# Altium project Light Sensor.PrjPCB
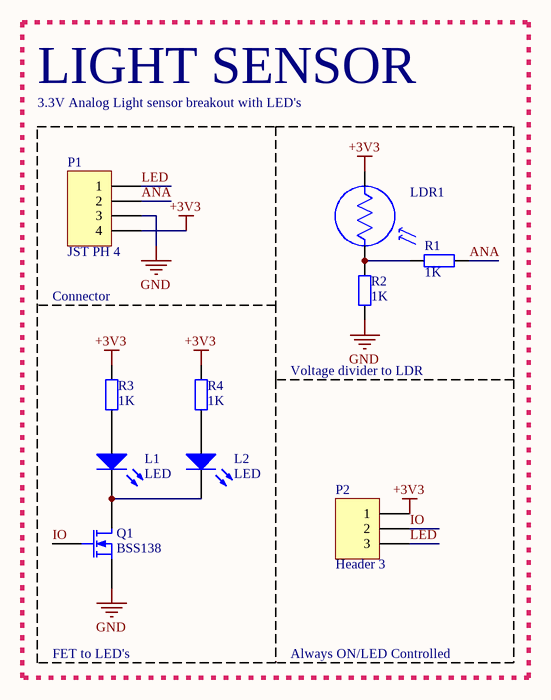
[diagram p0: Light Sensor Breakout.SchDoc]
1 sheet, 10 parts. Net scope: global (net labels, ports and power ports of the same name join across sheets).
Board file: Light Sensor Breakout.PcbDoc

## Sheet Light Sensor Breakout.SchDoc
size A4

### Parts
L1  LED  [LED-5mm]
L2  LED  [LED-5mm]
LDR1  LDR  [LDR-5mm]  (value not drawn)
P1  JST PH 4  [B4B-PH-K]
P2  Header 3  [HDR1X3]
Q1  BSS138  [SOT23]
R1  1K  [RES1206]
R2  1K  [RES1206]
R3  1K  [RES1206]
R4  1K  [RES1206]

### Nets
+3V3: LDR1.1 P1.4 P2.1 R3.2 R4.2
GND: P1.3 Q1.2(S) R2.1
ANA: P1.2 R1.1
IO: P2.2 Q1.3(G)
LED: P1.1 P2.3
NetL1_1: L1.1(A) R3.1
NetL1_2: L1.2(K) L2.2(K) Q1.1(D)
NetL2_1: L2.1(A) R4.1
NetLDR1_2: LDR1.2 R1.2 R2.2

### Notes on the sheet
- LIGHT SENSOR
- 3.3V Analog Light sensor breakout with LED's
- Connector
- Voltage divider to LDR
- FET to LED's
- Always ON/LED Controlled

### Library data of the parts
P2 = Header 3: Header, 3-Pin; LatestRevisionDate: 17-Jul-2002; LatestRevisionNote: Re-released for DXP Platform.; Publisher: Altium Limited
Q1 = BSS138: N-Channel Enhancement Mode Vertical DMOS FET; Published: 17-Dec-2003; DatasheetVersion: Mar-96; PackageVersion: 1996; PackageReference: SOT23; Publisher: Altium Limited; PackageDescription: SOT-23; 3 Leads; Body 3.1 x 2.5 mm, inc. leads (LxW max), Alternate Lead Configuration; ComponentLink1Description: Manufacturer Link; ComponentLink1URL: http://www.zetex.com/; ComponentLink2Description: Datasheet; ComponentLink2URL: www.zetex.com/3.0/pdf/BSS138.pdf
R1-R4 = RES